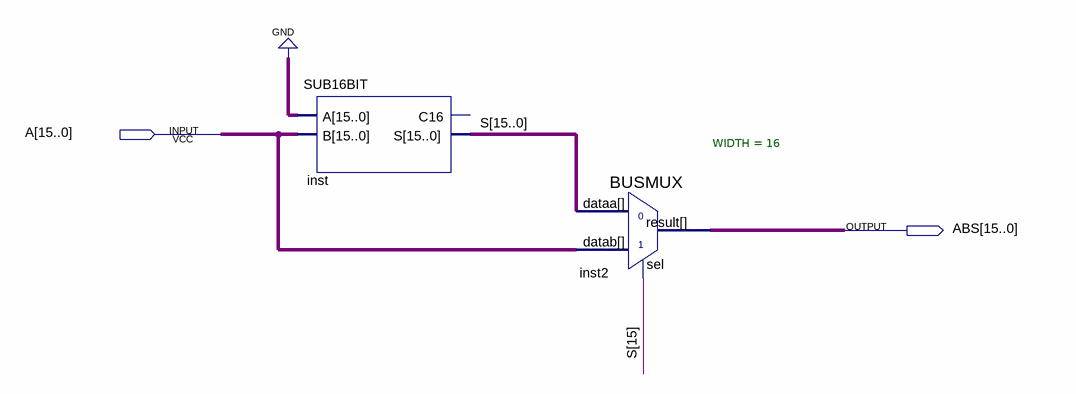
[diagram p0: schematic sheet]
// Quartus schematic ABS.bdf as structural Verilog: 2 symbols, 2 pins
module ABS (
  input  [15:0] A,
  output [15:0] ABS
);

  wire [15:0] S;

  SUB16BIT inst (.A({16{1'b0}}), .B(A), .S(S));  // open: C16
  BUSMUX #(.WIDTH(16)) inst2 (.datab(A), .sel(S[15]), .dataa(S), .result(ABS));
endmodule
